# EasyEDA Pro project ProPrj_MSP_M0_G3507_扩展板_2025-09-12.epro, schematic Schematic1
Board Name: Board1; Create Date: 2025-07-25; Page Name: P1; Project Name: MSP_M0_G3507_扩展板; Schematic Name: Schematic1; Update Date: 2025-07-26; Add into BOM: yes; Company: 嘉立创EDA; Convert to PCB: yes; Page Size: A4; Version: V1.0
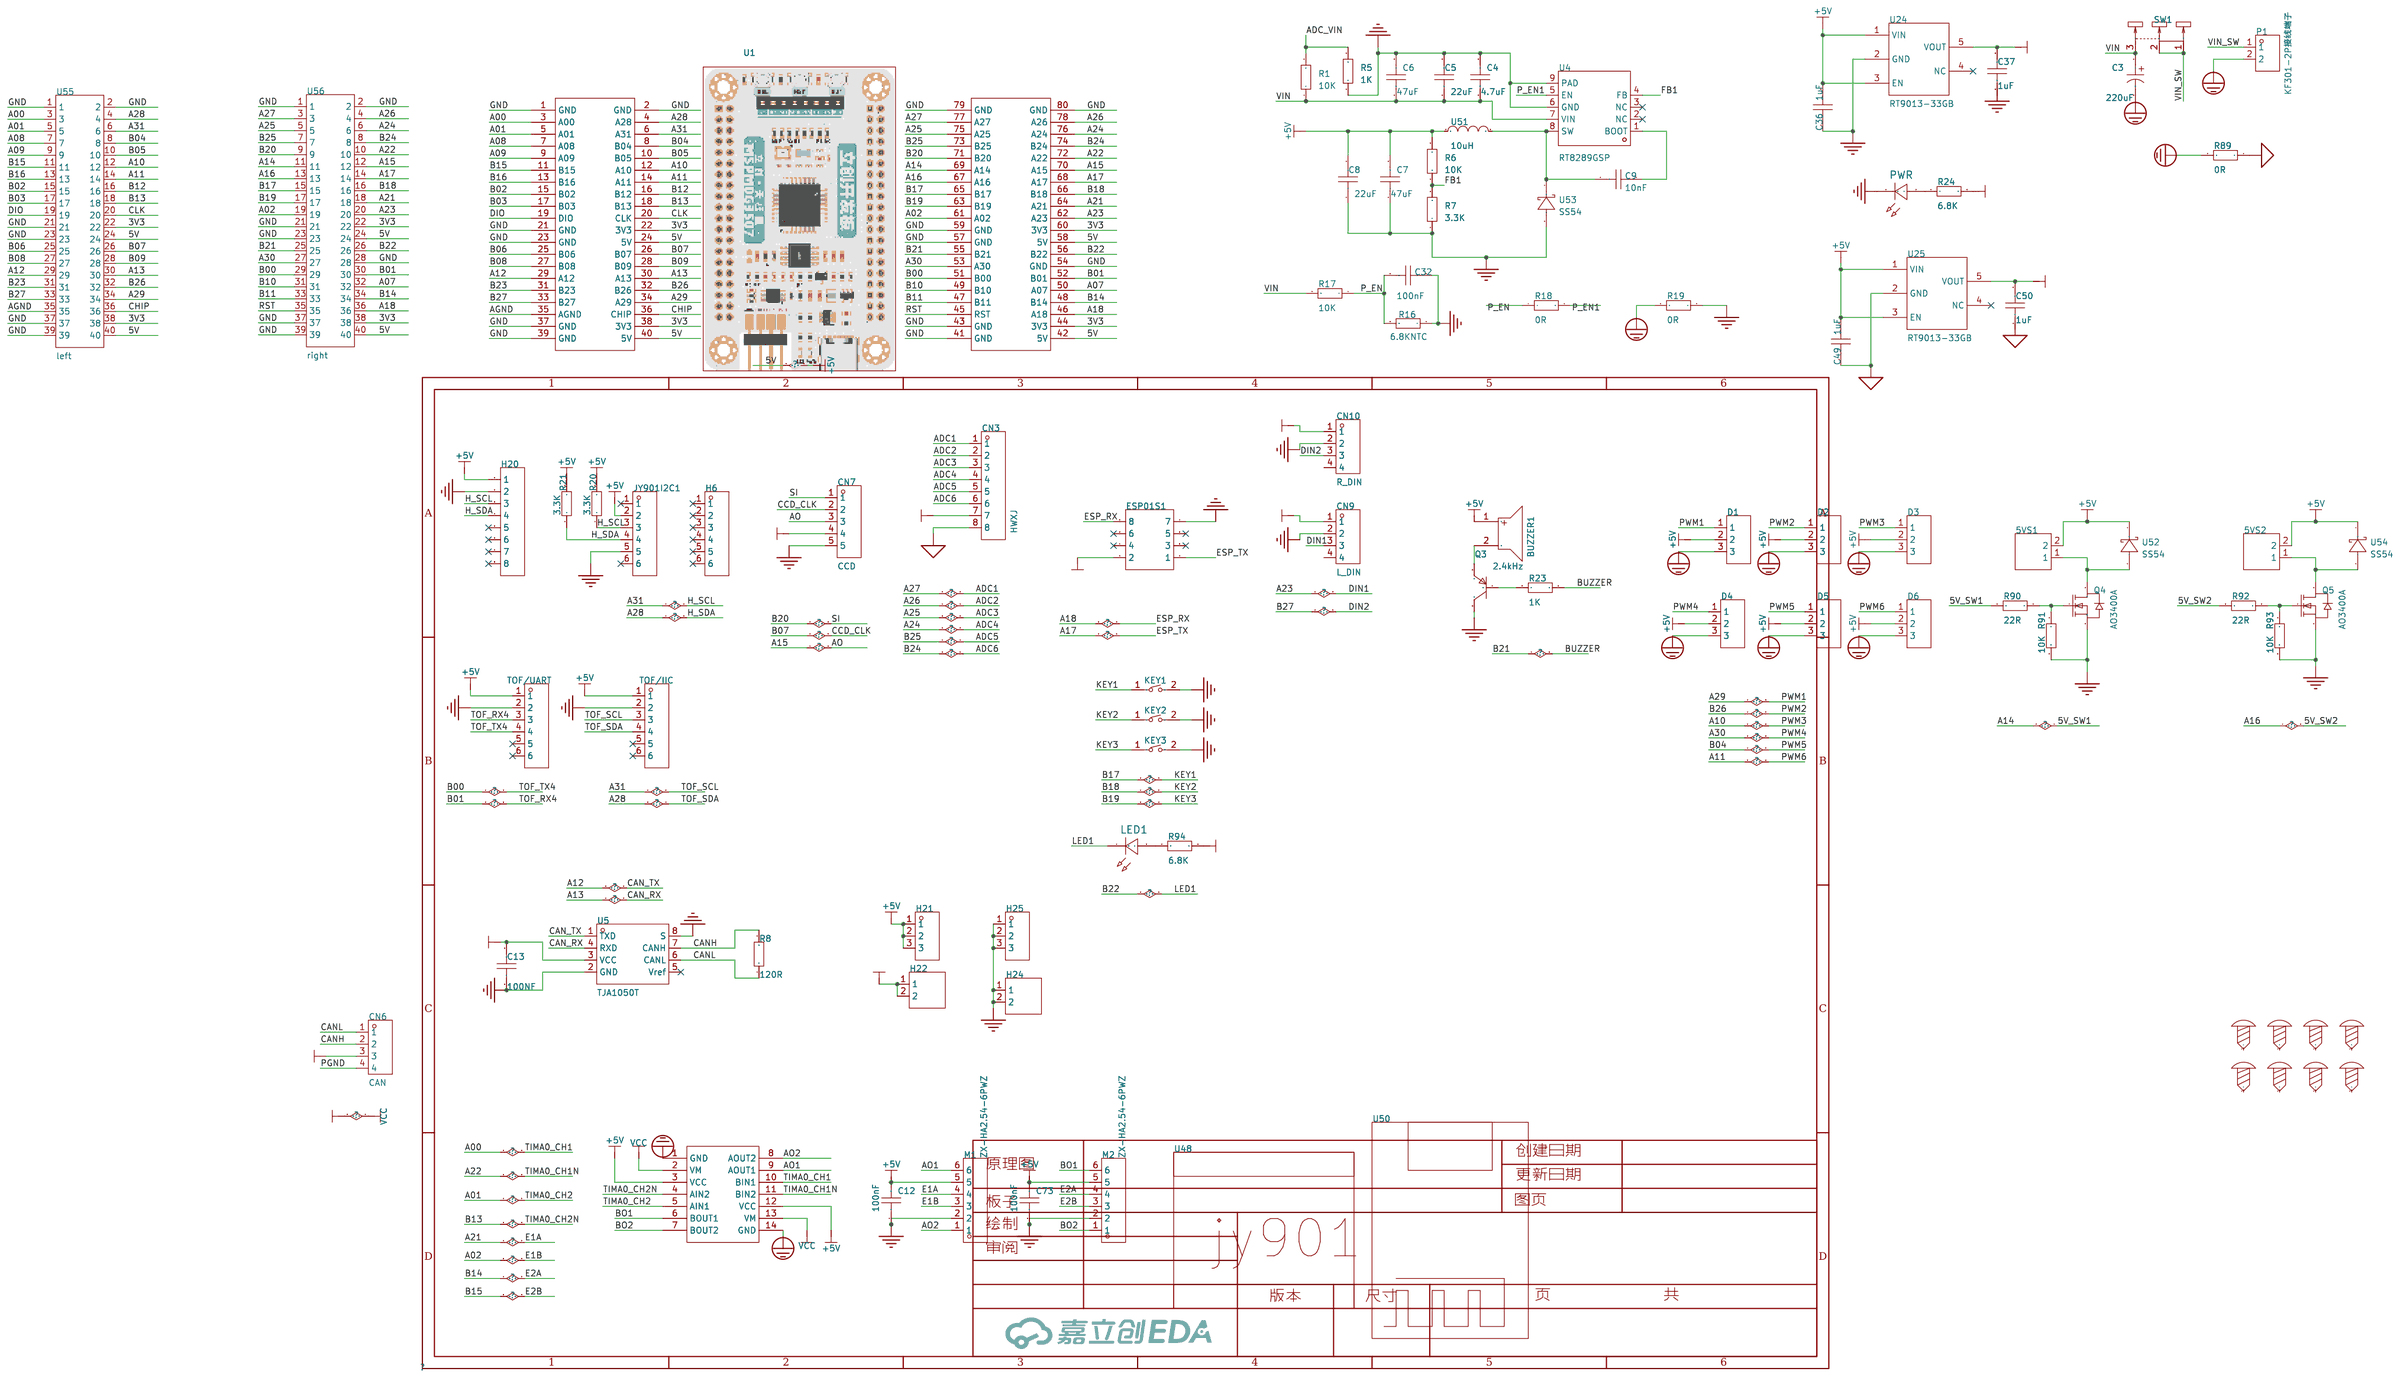
[diagram p0: schematic sheet]

## Parts
5VS1  -  [HDR-TH_2P-P2.54-V-M-1]
5VS2  -  [HDR-TH_2P-P2.54-V-M-1]
BUZZER1  2.4kHz  [BUZ-TH_BD12.0-P7.60-D0.6-FD]
C3  220uF  [CAP-SMD_BD8.0-L8.3-W8.3-LS9.1-FD]
C4  4.7uF  [C0603]
C5  22uF  [C1206]
C6  47uF  [C1206]
C7  47uF  [C1206]
C8  22uF  [C1206]
C9  10nF  [C0603]
C12  100nF  [C0603]
C13  100NF  [C0603]
C32  100nF  [C0603]
C36  1uF  [C0603]
C37  1uF  [C0603]
C49  1uF  [C0603]
C50  1uF  [C0603]
C73  100nF  [C0603]
CN3  HWXJ  [CONN-TH_8P-P2.50-XH2.54-8P]
CN6  CAN  [CONN-TH_XH-4AW]
CN7  CCD  [CONN-TH_5P-P2.50_XH-5A]
CN9  L_DIN  [CONN-TH_XH-4AW]
CN10  R_DIN  [CONN-TH_XH-4AW]
D1  PZ254V-11-03P  [HDR-TH_3P-P2.54-V-M]
D2  PZ254V-11-03P  [HDR-TH_3P-P2.54-V-M]
D3  PZ254V-11-03P  [HDR-TH_3P-P2.54-V-M]
D4  PZ254V-11-03P  [HDR-TH_3P-P2.54-V-M]
D5  PZ254V-11-03P  [HDR-TH_3P-P2.54-V-M]
D6  PZ254V-11-03P  [HDR-TH_3P-P2.54-V-M]
ESP01S1  -  [HDR-TH_8P-P2.54-V-F-R2-C4-S2.54-1]
H6  -  [HDR-TH_6P-P2.54-V-F]
H20  -  [HDR-TH_8P-P2.54-V-F-1]
H21  -  [HDR-TH_3P-P2.54-V-M]
H22  -  [HDR-TH_2P-P2.54-V-M-1]
H24  -  [HDR-TH_2P-P2.54-V-M-1]
H25  -  [HDR-TH_3P-P2.54-V-M]
JY901I2C1  -  [HDR-TH_6P-P2.54-V-F]
KEY1  ZX-QC34-2TPDZ  [KEY-SMD_L3.9-W3.0-LS5.0-EH]
KEY2  ZX-QC34-2TPDZ  [KEY-SMD_L3.9-W3.0-LS5.0-EH]
KEY3  ZX-QC34-2TPDZ  [KEY-SMD_L3.9-W3.0-LS5.0-EH]
LED1  -  [LED_0805]
M1  ZX-HA2.54-6PWZ  [CONN-TH_6P-P2.50_ZX-HA2.54-6PWZ-Y]
M2  ZX-HA2.54-6PWZ  [CONN-TH_6P-P2.50_ZX-HA2.54-6PWZ-Y]
P1  KF301-2P接线端子  [CONN-TH_XY301V-A-5.0-2P]
PWR  -  [LED_0805]
Q3  -  [S8550P_SOT]
Q4  AO3400A  [SOT-23-3_L2.9-W1.3-P1.90-LS2.4-BR]
Q5  AO3400A  [SOT-23-3_L2.9-W1.3-P1.90-LS2.4-BR]
R1  10K  [R0805]
R5  1K  [R0805]
R6  10K  [R0805]
R7  3.3K  [R0805]
R8  120R  [R0805]
R16  6.8KNTC  [R0805]
R17  10K  [R0805]
R18  0R  [R0805]
R19  0R  [R0805]
R20  3.3K  [R0805]
R21  3.3K  [R0805]
R23  1K  [R0805]
R24  6.8K  [R0805]
R89  0R  [R0805]
R90  22R  [R0805]
R91  10K  [R0805]
R92  22R  [R0805]
R93  10K  [R0805]
R94  6.8K  [R0805]
SCREW1  -  [M3螺丝]
SCREW2  -  [M3螺丝]
SCREW3  -  [M3螺丝]
SCREW4  -  [M3螺丝]
SCREW5  -  [M3螺丝]
SCREW6  -  [M3螺丝]
SCREW7  -  [M3螺丝]
SCREW8  -  [M3螺丝]
SW1  SS-12D10L5  [SW-TH_SS-12D10L5]
TOF/IIC  -  [HDR-TH_6P-P2.54-V-F]
TOF/UART  -  [HDR-TH_6P-P2.54-V-F]
U1  LCKFB-TMX-MSPM0G3507  [COMM-TH_LCKFB-TMX-MSPM0G3507]
U4  RT8289GSP  [SOIC-8_L5.0-W4.0-P1.27-LS6.0-BL-EP2.0]
U5  TJA1050T  [SOIC-8_L4.9-W3.9-P1.27-LS6.0-BL]
U24  RT9013-33GB  [SOT-23-5_L3.0-W1.7-P0.95-LS2.8-BL]
U25  RT9013-33GB  [SOT-23-5_L3.0-W1.7-P0.95-LS2.8-BL]
U41  AT8236  [AT8236-Dual-Module]
U48  -  [jy901]
U50  -  [esp01s]
U51  10uH  [IND-SMD_L7.0-W6.6]
U52  SS54  [SMA_L4.2-W2.6-LS5.1-RD]
U53  SS54  [SMA_L4.2-W2.6-LS5.1-RD]
U54  SS54  [SMA_L4.2-W2.6-LS5.1-RD]
U55  left  [HDR-TH_40P-P2.54-V-M-R2-C20-S2.54]
U56  right  [HDR-TH_40P-P2.54-V-M-R2-C20-S2.54]

## Library data of the parts
5VS1 5VS2 H22 H24 = HDR-M_2.54_1x2P: Supplier Part: C124375; Supplier Footprint: 插件
BUZZER1 = TMB12A05: 驱动方式:有源(内含驱动线路);构造类型:电磁式;频率:2.4kHz;声压(SPL):88dB;; LCSC Part Name: 有源电磁式蜂鸣器; Supplier Part: C781860; Manufacturer: YUEXIN(悦馨); Supplier Footprint: 插件,D=12mm; Datasheet: https://atta.szlcsc.com/upload/public/pdf/source/20200927/C781859_CEC7B7F6A9D62F380D126441DF0F265C.pdf; Supplier: LCSC; Driver Circuitry: 有源(内含驱动线路); Technology: 电磁式; Voltage - Supply: 4V~8V; Current Consumption: 30mA; Sound Pressure Level(SPL): 88dB; Diameter(φD): 12mm; Height: 9.5mm; Operating Temperature: -30℃~+85℃
C3 = RVT220UF25V67RV0093: 容值:220uF;精度:±20%;额定电压:25V;纹波电流:183mA@120Hz;等效串联电阻:-;; LCSC Part Name: 220uF ±20% 25V; Supplier Part: C2895286; Manufacturer: KNSCHA(科尼盛); Supplier Footprint: SMD,D8xL10.2mm; Datasheet: https://atta.szlcsc.com/upload/public/pdf/source/20210913/8A61C31497A01FCF4FA27D71FB0D1012.pdf; Supplier: LCSC; Tolerance: ±20%; Rated Voltage: 25V; Ripple Current: 183mA@120Hz; φD: 8mm; L: 10.2mm; Lifetime @ Temp: 2000hrs@105℃; Operating Temperature: -55℃~+105℃
C4 C9 C12 C13 C32 C36 C37 C49 C50 C73 = CAP_0603: Supplier Footprint: 0603
C5-C8 = TCC1206X5R226K100HT: 容值:22uF;精度:±10%;额定电压:10V;温度系数:X5R;; LCSC Part Name: 22uF ±10% 10V; Supplier Part: C7393980; Manufacturer: CCTC(三环); Supplier Footprint: 1206; JLCPCB Part Class: 扩展库; Datasheet: https://atta.szlcsc.com/upload/public/pdf/source/20230606/1C21CCC6A1C08E8C3D36DB4723A2CB7D.pdf; Supplier: LCSC; Tolerance: ±10%; Voltage Rating: 10V; Temperature Coefficient: X5R
CN3 = ZX-XH2.54-8PZZ: 插针结构:1x8P;间距:2.5mm;安装方式:直插;参考系列:XH;总PIN数:8P;排数:1;每排PIN数:8;行距:-;额定电流:3A;触头材质:黄铜;触头镀层:锡;工作温度:-25℃~+85℃;; LCSC Part Name: 1x8P 间距:2.5mm 直插 系列:XH; Supplier Part: C7429638; Manufacturer: Megastar(兆星); Supplier Footprint: 插件,P=2.5mm; JLCPCB Part Class: 扩展库; Datasheet: https://atta.szlcsc.com/upload/public/pdf/source/20230619/688603DEA58996C00B1F33C46797D2C3.pdf; Supplier: LCSC; Pins Structure: 1x8P; Pitch: 2.5mm; Mounting Type: 直插; Reference Series: XH; Number of Pins: 8P; Number of Rows: 1; Number of PINs Per Row: 8; Current Rating: 3A; Contact Material: 黄铜; Contact Plating: 锡; Operating Temperature: -25℃~+85℃; Voltage Rating: 250V; Plastic Material: PA66; Flame Retardant Rating: UL94V-0; Color: 白色; Z-Height of the Board: 7mm; X-Length of Bottom Edge on Board (Spacing Line): 22.5mm; Y-Width of Bottom Edge on Board: 5.9mm
CN6 CN9 CN10 = XH-4AW: 插针结构:1x4P;间距:2.54mm;安装方式:弯插;参考系列:XH;总PIN数:4P;排数:1;每排PIN数:4;行距:-;额定电流:3A;触头材质:黄铜;触头镀层:锡;工作温度范围:-25℃~+85℃;; LCSC Part Name: 1x4P 间距:2.54mm 弯插 系列:XH; Supplier Part: C2908613; Manufacturer: HCTL(华灿天禄); Supplier Footprint: 弯插,P=2.5mm; JLCPCB Part Class: 扩展库; Datasheet: https://atta.szlcsc.com/upload/public/pdf/source/20230711/B565BAF3B11666EF6B81B3605408F2BD.pdf; Supplier: LCSC; Pins Structure: 1x4P; Pitch: 2.54mm; Mounting Style: 弯插; Reference Series: XH; Number of Pins: 4P; Number of Rows: 1; Number of PINs Per Row: 4; Current Rating (Max): 3A; Contact Material: 黄铜; Contact Plating: 锡; Operating Temperature Range: -25℃~+85℃
CN7 = XH-5A_C2908603: 插针结构:1x5P;间距:2.5mm;安装方式:直插;参考系列:XH;总PIN数:5P;排数:1;每排PIN数:5;行距:-;额定电流:3A;触头材质:黄铜;触头镀层:锡;工作温度范围:-25℃~+85℃;; LCSC Part Name: 1x5P 间距:2.5mm 直插 系列:XH; Supplier Part: C2908603; Manufacturer: HCTL(华灿天禄); Supplier Footprint: 插件,P=2.5mm; JLCPCB Part Class: 扩展库; Datasheet: https://atta.szlcsc.com/upload/public/pdf/source/20230711/68D365716984B4AFE576D1D73D61B465.pdf; Supplier: LCSC; Pins Structure: 1x5P; Pitch: 2.5mm; Mounting Style: 直插; Reference Series: XH; Number of Pins: 5P; Number of Rows: 1; Number of PINs Per Row: 5; Current Rating (Max): 3A; Contact Material: 黄铜; Contact Plating: 锡; Operating Temperature Range: -25℃~+85℃
D1-D6 = PZ254V-11-03P: 插针结构:1x3P;间距:2.54mm;行距:-;圆针/方针:方针;安装方式:直插;排数:单排;总PIN位数:3P;额定电流:3A;额定电压:250V;配合针长度:6mm;塑高:2.5mm;端接针长度:3mm;工作温度:-40℃~+105℃;颜色:黑色;; LCSC Part Name: 1x3P 间距:2.54mm 方针 直插; Supplier Part: C2937625; Manufacturer: XFCN(兴飞); Supplier Footprint: 插件,P=2.54mm; JLCPCB Part Class: 扩展库; Datasheet: https://atta.szlcsc.com/upload/public/pdf/source/20200309/C492402_8335C3D49C4E4C618838D59BB1D024C1.pdf; Supplier: LCSC; Pin Structure: 1x3P; Pitch: 2.54mm; Circluar Pins/Square Pins: 方针; Mounting Type: 直插; Number of Rows: 单排; Number of Pins: 3P; Current Rating: 3A; Voltage Rating (Max): 250V; Length of Mating Pin: 6mm; Insulation Height: 2.5mm; Length of End Connection Pin: 3mm; Operating Temperature: -40℃~+105℃; Color: 黑色
ESP01S1 = HDR-F_2.54_2x4: Supplier Part: C92271; Supplier Footprint: 插件
H6 JY901I2C1 TOF/IIC TOF/UART = HDR-F_2.54_1x6P: Supplier Part: C40877; Supplier Footprint: 插件
H20 = HDR-F_2.54_1x8P: Supplier Part: C27438; Supplier Footprint: 插件
H21 H25 = HDR-M_2.54_1x3P: Supplier Part: C2937625; Supplier Footprint: 插件
KEY1-KEY3 = ZX-QC34-2TPDZ: 电路结构:单刀单掷;按钮形状:圆形按钮;作用力:2.6N;安装方式:立贴;开关长度:3mm;开关宽度:4mm;开关高度:2mm;带支架:不带支架;触点电流:50mA;额定电压:12V;机械寿命:10万次;; LCSC Part Name: 3*4*2贴片开关带柱; Supplier Part: C7470219; Manufacturer: Megastar(兆星); Supplier Footprint: SMD; JLCPCB Part Class: 扩展库; Datasheet: https://atta.szlcsc.com/upload/public/pdf/source/20230724/D2731FAADF93973E25928DE23F241F8A.pdf; Supplier: LCSC; Circuit: 单刀单掷; Actuator Style: 圆形按钮; Operating Force: 2.6N; Mounting Style: 立贴; Switch Length: 3mm; Switch Width: 4mm; Switch Height: 2mm; Strike Gundam: 不带支架; Contact Current: 50mA; Voltage Rating: 12V; Actuator/Cap Color: 黑色; Pin Style: 鸥翼型; Mechanical Life: 10万次; Operating Temperature: -30℃~+80℃
LED1 PWR = LED_0805-R: Supplier Footprint: 0805
M1 M2 = ZX-HA2.54-6PWZ: 插针结构:1x6P;间距:2.5mm;安装方式:弯插;参考系列:XHB;总PIN数:6P;排数:1;每排PIN数:6;行距:-;额定电流:3A;触头材质:黄铜;触头镀层:锡;工作温度范围:-25℃~+85℃;; LCSC Part Name: 1x6P 间距:2.5mm 弯插 系列:XHB 配套胶壳型号：ZX-HA2.54-6PJK 配套端子型号：ZX-HA2.54-DZ 配套杜邦线型号：ZX-HA2.54-6PBXC; Supplier Part: C7429627; Manufacturer: Megastar(兆星); Supplier Footprint: 弯插,P=2.54mm; Datasheet: https://atta.szlcsc.com/upload/public/pdf/source/20230619/581D607A06B0BC1DBA7ECC32C5D6D2DA.pdf; Supplier: LCSC; Pins Structure: 1x6P; Pitch: 2.5mm; Mounting Style: 弯插; Reference Series: XHB; Number of Pins: 6P; Number of Rows: 1; Number of PINs Per Row: 6; Current Rating (Max): 3A; Contact Material: 黄铜; Contact Plating: 锡; Operating Temperature Range: -25℃~+85℃; Rated Voltage (Max): 250V; Plastic Material: PA66; Flame Retardant Rating: UL94V-0; Colour: 白色; Z-Height of the Board: 6.35mm; X-Length of Bottom Edge on Board (Spacing Line): 17.5mm; Y-Width of Bottom Edge on Board: 7.42mm
P1 = KF301-2P接线端子: Supplier Part: C9900016950; Supplier Footprint: CK301-2P; JLCPCB Part Class: 扩展库; Supplier: LCSC
Q3 = S8550_SOT_PNP: Supplier Footprint: SOT-23
Q4 Q5 = AO3400A: 类型:1个N沟道;漏源电压(Vdss):30V;连续漏极电流(Id):5.2A;导通电阻(RDS(on)@Vgs,Id):27mΩ@4.5V,5A;功率(Pd):1W;阈值电压(Vgs(th)@Id):850mV@250uA;; LCSC Part Name: N沟道,电流:5.2A,耐压:30V; Supplier Part: C700953; Manufacturer: HUASHUO(华朔); Supplier Footprint: SOT-23; Datasheet: https://atta.szlcsc.com/upload/public/pdf/source/20200713/C700953_2C399A25E2B0CA38CA8BE1B404780CC1.pdf; Supplier: LCSC; Type: 1个N沟道; Drain Source Voltage (Vdss): 30V; Continuous Drain Current (Id): 5.2A; Drain Source On Resistance (RDS(on)@Vgs,Id): 27mΩ@4.5V,5A; Power Dissipation (Pd): 1W; Gate Threshold Voltage (Vgs(th)@Id): 850mV@250uA; Total Gate Charge (Qg@Vgs): 11.7nC@4.5V; Input Capacitance (Ciss@Vds): 927pF@15V; Reverse Transfer Capacitance (Crss@Vds): 61pF@15V; Operating Temperature: -55℃~+150℃
R1 R5-R8 R16-R21 R23 R24 R89-R94 = Res_0805: Supplier Footprint: 0805
SCREW1-SCREW8 = M3螺丝: Supplier Footprint: 插件
SW1 = SS-12D10L5: 电路结构:单刀双掷;安装方式:直插;开关颜色:黑色;额定电流(DC):3A;额定电压(DC):125V;额定电流(AC):3A;额定电压(AC):125V;机械寿命:1万次;; LCSC Part Name: 柄长5mm 直插双档 滑动开关; Supplier Part: C319012; Manufacturer: XKB Connectivity(中国星坤); Supplier Footprint: 插件; JLCPCB Part Class: 扩展库; Datasheet: https://atta.szlcsc.com/upload/public/pdf/source/20211009/D6412F37AABE6F9459A6EE7FA4DAEADB.pdf; Supplier: LCSC; Circuit: 单刀双掷; Actuator Style: 矩形柱状; Pin Style: PC引脚; Switch Length: 13mm; Switch Width: 6.8mm; Switch Height: 6.4mm; Mounting Style: 直插; Actuator Color: 黑色; Current Rating (DC): 3A; Voltage Rating (DC): 125V; Current Rating (AC): 3A; Voltage Rating (AC): 125V; Mechanical Life: 1万次; Operating Temperature: -40℃~+85℃
U1 = LCKFB-TMX-MSPM0G3507: LCSC Part Name: 立创·天猛星MSPM0G3507开发板 5件套; Supplier Part: C42378531; Manufacturer: 立创开发板; Datasheet: https://atta.szlcsc.com/upload/public/pdf/source/20241209/800332349277522348D9357AB5109808.pdf; Supplier: LCSC
U4 = RT8289GSP: 功能类型:降压型;输出类型:可调;工作电压:5.5V~32V;输出电压:1.222V~26V;输出电流:5A;; LCSC Part Name: 5A 32V 500kHz 降压转换器; Supplier Part: C39202; Manufacturer: RICHTEK(立锜); Supplier Footprint: SOIC-8-EP; JLCPCB Part Class: 扩展库; Datasheet: https://atta.szlcsc.com/upload/public/pdf/source/20141219/1457707253176.pdf; Supplier: LCSC; Function: 降压型; Output Type: 可调; Input Voltage: 5.5V~32V; Output Voltage: 1.222V~26V; Output Current: 5A; Switching Frequency: 500kHz; Operating Temperature: -40℃~+125℃; Synchronous Rectification: 否; Number of Outputs: 1; Topology: 降压式; Quiescent Current (Iq): 25uA; Switch tube (built-in/external): 内置
U5 = TJA1050T: Supplier Part: C23069945; Manufacturer: NXP(恩智浦); Supplier: LCSC
U24 U25 = RT9013-33GB: 输出类型:固定;最大输入电压:5.5V;输出电压:3.3V;输出电流:500mA;电源纹波抑制比(PSRR):50dB@(10kHz);输出极性:正极;; LCSC Part Name: 输入5.5V 输出3.3V 500mA; Supplier Part: C47773; Manufacturer: RICHTEK(立锜); Supplier Footprint: SOT-23-5; JLCPCB Part Class: 扩展库; Datasheet: https://atta.szlcsc.com/upload/public/pdf/source/20150504/1457707282459.pdf; Supplier: LCSC; Output Type: 固定; Maximum Input Voltage: 5.5V; Output Voltage: 3.3V; Output Current: 500mA; Power Supply Rejection Ratio (PSRR): 50dB@(10kHz); Dropout Voltage: 400mV@(500mA); standby current: 50uA; Feature: 低ESR；防静电保护；热保护(TSD)；过流保护(OCP)；带使能; Operating Temperature: -40℃~+85℃; Output Polarity: 正极; Number of Outputs: 1
U41 = AT8236-Dual-Module
U48 = jy901s
U50 = esp01s
U51 = XR0650-100M: 电感值:10uH;精度:±20%;额定电流:4.5A;饱和电流(Isat):5.3A;类型:一体成型电感;; LCSC Part Name: 10uH ±20% 5.3A; Supplier Part: C5307639; Manufacturer: XR(祥如); Supplier Footprint: SMD,0650; Datasheet: https://atta.szlcsc.com/upload/public/pdf/source/20240328/59447808532B1F4BFDB10AEA5999ED07.pdf; Supplier: LCSC; Tolerance: ±20%; Current Rating: 4.5A; Current - Saturation(Isat): 5.3A; DC Resistance(DCR): 60mΩ; Type: 一体成型电感
U52-U54 = SS54: Supplier Part: C9900023219; Supplier Footprint: (1N5824)DO-214; Supplier: LCSC
U55 U56 = PZ2.54-2*20: 插针结构:2x20P;间距:2.54mm;安装方式:直插;排数:双排;总PIN位数:40P;触头镀层:金;; LCSC Part Name: 2x20P 间距:2.54mm 直插; Supplier Part: C5224014; Manufacturer: ZHOURI(洲日); Supplier Footprint: 插件,P=2.54mm; JLCPCB Part Class: 扩展库; Datasheet: https://atta.szlcsc.com/upload/public/pdf/source/20221102/7E8316C38DB6D81BB18273F4CFF8B2F6.pdf; Supplier: LCSC; Pin Structure: 2x20P; Pitch: 2.54mm; Mounting Type: 直插; Number of Rows: 双排; Number of Pins: 40P; Contact Plating: 金

## Nets
3V3: C37.2 CN7.4 CN9.1 CN10.1 ESP01S1.2 H22.1 H22.2 R24.2 R94.2 U1.22(3V3) U1.38(3V3) U1.44(3V3) U1.60(3V3) U24.5(VOUT) U55.22 U55.38 U56.22 U56.38
5V_SW1: R90.2 U1.69(A14) U56.11
5V_SW2: R92.2 U1.67(A16) U56.13
+5V: 5VS1.2 5VS2.2 BUZZER1.1 C7.2 C8.2 C12.2 C13.1 C36.2 C49.2 C73.2 D1.2 D2.2 D3.2 D4.2 D5.2 D6.2 H20.1 H21.1 H21.2 H21.3 JY901I2C1.2 M1.5 M2.5 R6.2 R20.2 R21.2 TOF/IIC.1 TOF/UART.1 U1.24(5V) U1.40(5V) U1.42(5V) U1.58(5V) U5.3(VCC) U24.1(VIN) U24.3(EN) U25.1(VIN) U25.3(EN) U41.3(VCC) U41.12(VCC) U51.1 U52.1(C) U54.1(C) U55.24 U55.40 U56.24 U56.40
A3V3: C50.2 CN3.7 U25.5(VOUT)
AGND: C49.1 C50.1 CN3.8 R89.1 U1.35(AGND) U25.2(GND) U55.35
GND: C4.2 C5.2 C6.2 C7.1 C8.1 C12.1 C13.2 C32.1 C36.1 C37.1 C73.1 CN7.5 CN9.2 CN10.2 ESP01S1.7 H20.2 H24.1 H24.2 H25.1 H25.2 H25.3 JY901I2C1.5 KEY1.2 KEY2.2 KEY3.2 M1.2 M2.2 PWR.1(C) Q3.3(C) Q4.2(S) Q5.2(S) R5.1 R7.1 R16.1 R19.1 R91.2 R93.2 TOF/IIC.2 TOF/UART.2 U1.1(GND) U1.2(GND) U1.21(GND) U1.23(GND) U1.37(GND) U1.39(GND) U1.41(GND) U1.43(GND) U1.54(GND) U1.57(GND) U1.59(GND) U1.79(GND) U1.80(GND) U4.6(GND) U4.9(PAD) U5.2(GND) U5.8(S) U24.2(GND) U53.2(A) U55.1 U55.2 U55.21 U55.23 U55.37 U55.39 U56.1 U56.2 U56.21 U56.23 U56.28 U56.37 U56.39
PGND: C3.2 CN6.4 D1.3 D2.3 D3.3 D4.3 D5.3 D6.3 P1.2 R19.2 R89.2 U41.1(GND) U41.14(GND)
VCC: C3.1 C4.1 C5.1 C6.1 CN6.3 R1.1 R17.2 SW1.3 U4.7(VIN) U41.2(VM) U41.13(VM)
VIN_SW: P1.1 SW1.1 SW1.2
A00: U1.3(A00) U41.10(BIN1) U55.3
A01: U1.5(A01) U41.5(AIN1) U55.5
A02: M1.3 U1.61(A02) U56.19
A07: U1.50(A07) U56.32
A08: U1.7(A08) U55.7
A09: U1.9(A09) U55.9
A10: D3.1 U1.12(A10) U55.12
A11: D6.1 U1.14(A11) U55.14
A12: U1.29(A12) U5.1(TXD) U55.29
A13: U1.30(A13) U5.4(RXD) U55.30
A15: CN7.3 U1.70(A15) U56.12
A17: ESP01S1.1 U1.68(A17) U56.14
A18: ESP01S1.8 U1.46(A18) U56.36
A21: M1.4 U1.64(A21) U56.18
A22: U1.72(A22) U41.11(BIN2) U56.10
A23: CN9.3 U1.62(A23) U56.20
A24: CN3.4 U1.76(A24) U56.6
A25: CN3.3 U1.75(A25) U56.5
A26: CN3.2 U1.78(A26) U56.4
A27: CN3.1 U1.77(A27) U56.3
A28: H20.4 JY901I2C1.4 R21.1 TOF/IIC.4 U1.4(A28) U55.4
A29: D1.1 U1.34(A29) U55.34
A30: D4.1 U1.53(A30) U56.27
A31: H20.3 JY901I2C1.3 R20.1 TOF/IIC.3 U1.6(A31) U55.6
ADC5: CN3.5 U1.73(B25) U56.7
ADC6: CN3.6 U1.74(B24) U56.8
ADC_VIN: R1.2 R5.2
AO1: M1.6 U41.9(AOUT1)
AO2: M1.1 U41.8(AOUT2)
B00: TOF/UART.4 U1.51(B00) U56.29
B01: TOF/UART.3 U1.52(B01) U56.30
B02: U1.15(B02) U55.15
B03: U1.17(B03) U55.17
B04: D5.1 U1.8(B04) U55.8
B05: U1.10(B05) U55.10
B06: U1.25(B06) U55.25
B07: CN7.2 U1.26(B07) U55.26
B08: U1.27(B08) U55.27
B09: U1.28(B09) U55.28
B10: U1.49(B10) U56.31
B11: U1.47(B11) U56.33
B12: U1.16(B12) U55.16
B13: U1.18(B13) U41.4(AIN2) U55.18
B14: M2.4 U1.48(B14) U56.34
B15: M2.3 U1.11(B15) U55.11
B16: U1.13(B16) U55.13
B17: KEY1.1 U1.65(B17) U56.15
B18: KEY2.1 U1.66(B18) U56.16
B19: KEY3.1 U1.63(B19) U56.17
B20: CN7.1 U1.71(B20) U56.9
B21: R23.1 U1.55(B21) U56.25
B22: LED1.1(C) U1.56(B22) U56.26
B23: U1.31(B23) U55.31
B26: D2.1 U1.32(B26) U55.32
B27: CN10.3 U1.33(B27) U55.33
BO1: M2.6 U41.6(BOUT1)
BO2: M2.1 U41.7(BOUT2)
CANH: CN6.2 R8.2 U5.7(CANH)
CANL: CN6.1 R8.1 U5.6(CANL)
CHIP: U1.36(CHIP) U55.36
CLK: U1.20(CLK) U55.20
DIO: U1.19(DIO) U55.19
FB1: R6.1 R7.2 U4.4(FB)
P_EN: C32.2 R16.2 R17.1 R18.1
P_EN1: R18.2 U4.5(EN)
RST: U1.45(RST) U56.35
$1N1656: C9.2 U4.8(SW) U51.2 U53.1(C)
$1N1657: C9.1 U4.1(BOOT)
$1N1908: PWR.2(A) R24.1
$1N4369: Q3.1(B) R23.2
$1N4372: BUZZER1.2 Q3.2(E)
$1N7155: Q4.1(G) R90.1 R91.1
$1N7448: 5VS1.1 Q4.3(D) U52.2(A)
$1N7843: Q5.1(G) R92.1 R93.1
$1N7851: 5VS2.1 Q5.3(D) U54.2(A)
$1N10841: LED1.2(A) R94.1

Not connected (* = marked no-connect by the designer): CN9 4; CN10 4; ESP01S1 3* 4* 5* 6*; H6 1* 2* 3* 4* 5* 6*; H20 5* 6* 7* 8*; JY901I2C1 1* 6*; SCREW1 1; SCREW2 1; SCREW3 1; SCREW4 1; SCREW5 1; SCREW6 1; SCREW7 1; SCREW8 1; TOF/IIC 5* 6*; TOF/UART 5* 6*; U4 2(NC)* 3(NC)*; U5 5(Vref)*; U24 4(NC)*; U25 4(NC)*
